# Altium schematic sheet analog_converter.SchDoc
size B; Address1: MILWAUKEE TOOL; Address2: 13135 W. Lisbon Rd.; Address3: Brookfield, WI 53005; SheetNumber: 1; SheetTotal: 1
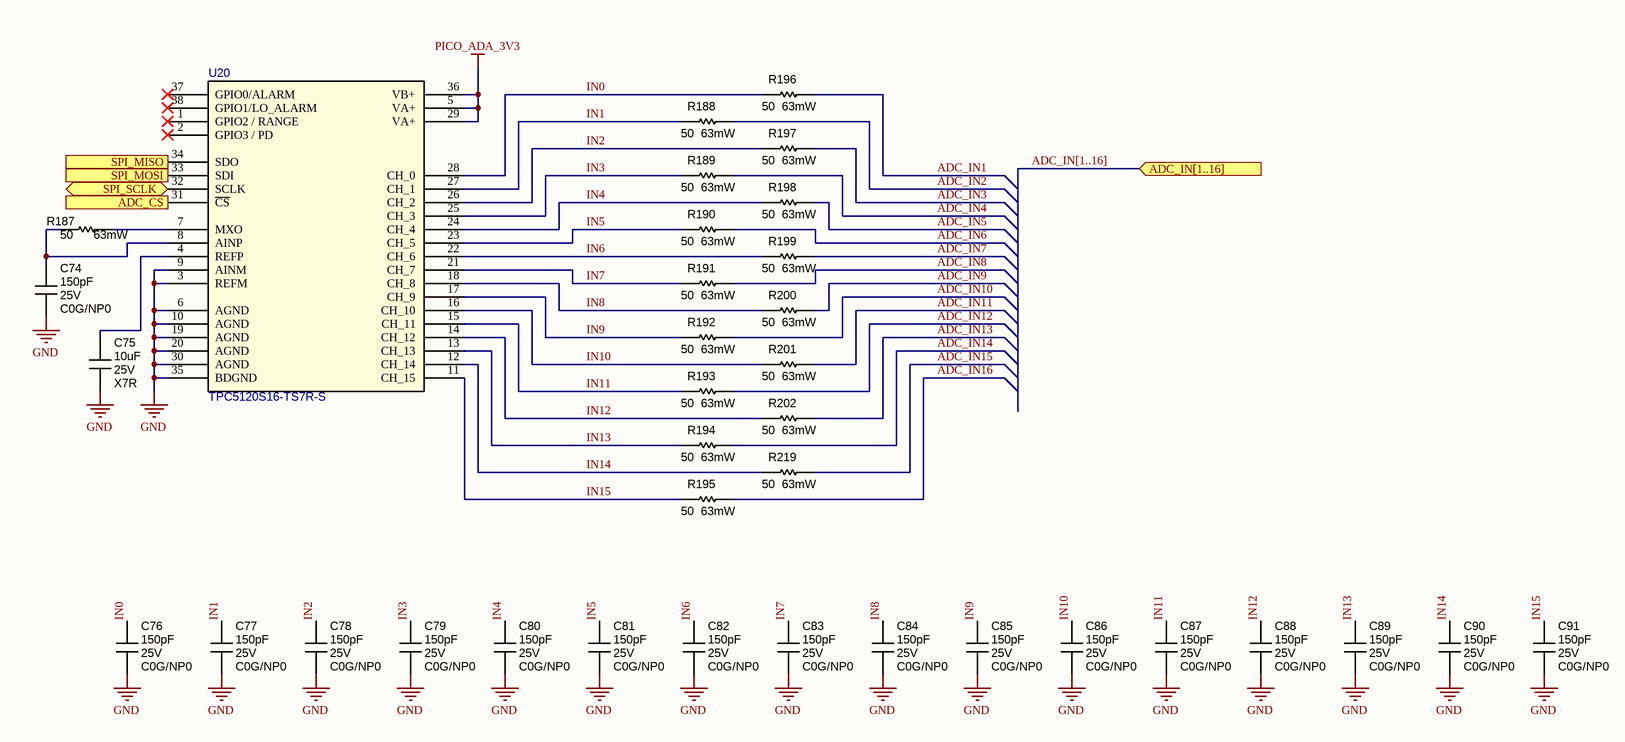
[diagram p0: analog_converter.SchDoc]

## Parts
C74  150pF  Voltage Rating: 25V  Temp Coeff: C0G/NP0  [CAPC1005X06N]
C75  10uF  Voltage Rating: 25V  Temp Coeff: X7R  [CAPC3225X28N]
C76  150pF  Voltage Rating: 25V  Temp Coeff: C0G/NP0  [CAPC1005X06N]
C77  150pF  Voltage Rating: 25V  Temp Coeff: C0G/NP0  [CAPC1005X06N]
C78  150pF  Voltage Rating: 25V  Temp Coeff: C0G/NP0  [CAPC1005X06N]
C79  150pF  Voltage Rating: 25V  Temp Coeff: C0G/NP0  [CAPC1005X06N]
C80  150pF  Voltage Rating: 25V  Temp Coeff: C0G/NP0  [CAPC1005X06N]
C81  150pF  Voltage Rating: 25V  Temp Coeff: C0G/NP0  [CAPC1005X06N]
C82  150pF  Voltage Rating: 25V  Temp Coeff: C0G/NP0  [CAPC1005X06N]
C83  150pF  Voltage Rating: 25V  Temp Coeff: C0G/NP0  [CAPC1005X06N]
C84  150pF  Voltage Rating: 25V  Temp Coeff: C0G/NP0  [CAPC1005X06N]
C85  150pF  Voltage Rating: 25V  Temp Coeff: C0G/NP0  [CAPC1005X06N]
C86  150pF  Voltage Rating: 25V  Temp Coeff: C0G/NP0  [CAPC1005X06N]
C87  150pF  Voltage Rating: 25V  Temp Coeff: C0G/NP0  [CAPC1005X06N]
C88  150pF  Voltage Rating: 25V  Temp Coeff: C0G/NP0  [CAPC1005X06N]
C89  150pF  Voltage Rating: 25V  Temp Coeff: C0G/NP0  [CAPC1005X06N]
C90  150pF  Voltage Rating: 25V  Temp Coeff: C0G/NP0  [CAPC1005X06N]
C91  150pF  Voltage Rating: 25V  Temp Coeff: C0G/NP0  [CAPC1005X06N]
R187  50  Wattage: 63mW  [RESC1005X04N]
R188  50  Wattage: 63mW  [RESC1005X04N]
R189  50  Wattage: 63mW  [RESC1005X04N]
R190  50  Wattage: 63mW  [RESC1005X04N]
R191  50  Wattage: 63mW  [RESC1005X04N]
R192  50  Wattage: 63mW  [RESC1005X04N]
R193  50  Wattage: 63mW  [RESC1005X04N]
R194  50  Wattage: 63mW  [RESC1005X04N]
R195  50  Wattage: 63mW  [RESC1005X04N]
R196  50  Wattage: 63mW  [RESC1005X04N]
R197  50  Wattage: 63mW  [RESC1005X04N]
R198  50  Wattage: 63mW  [RESC1005X04N]
R199  50  Wattage: 63mW  [RESC1005X04N]
R200  50  Wattage: 63mW  [RESC1005X04N]
R201  50  Wattage: 63mW  [RESC1005X04N]
R202  50  Wattage: 63mW  [RESC1005X04N]
R219  50  Wattage: 63mW  [RESC1005X04N]
U20  TPC5120S16-TS7R-S  [TSSOP50P640X120-38N]

## Ports
ADC_CS (in), ADC_IN[1..16] (in), SPI_MISO (out), SPI_MOSI (in), SPI_SCLK (bidir)

## Nets
GND: C74.2 C75.2 C76.2 C77.2 C78.2 C79.2 C80.2 C81.2 C82.2 C83.2 C84.2 C85.2 C86.2 C87.2 C88.2 C89.2 C90.2 C91.2 U20.3(REFM) U20.6(AGND) U20.9(AINM) U20.10(AGND) U20.19(AGND) U20.20(AGND) U20.30(AGND) U20.35(BDGND)
PICO_ADA_3V3: U20.5(VA+) U20.29(VA+) U20.36(VB+)
ADC_CS: U20.31(~{CS}) ; port ADC_CS
ADC_IN1: R196.2
ADC_IN2: R188.2
ADC_IN3: R197.2
ADC_IN4: R189.2
ADC_IN5: R198.2
ADC_IN6: R190.2
ADC_IN7: R199.2
ADC_IN8: R191.2
ADC_IN9: R200.2
ADC_IN10: R192.2
ADC_IN11: R201.2
ADC_IN12: R193.2
ADC_IN13: R202.2
ADC_IN14: R194.2
ADC_IN15: R219.2
ADC_IN16: R195.2
IN0: C76.1 R196.1 U20.28(CH_0)
IN1: C77.1 R188.1 U20.27(CH_1)
IN2: C78.1 R197.1 U20.26(CH_2)
IN3: C79.1 R189.1 U20.25(CH_3)
IN4: C80.1 R198.1 U20.24(CH_4)
IN5: C81.1 R190.1 U20.23(CH_5)
IN6: C82.1 R199.1 U20.22(CH_6)
IN7: C83.1 R191.1 U20.21(CH_7)
IN8: C84.1 R200.1 U20.18(CH_8)
IN9: C85.1 R192.1 U20.17(CH_9)
IN10: C86.1 R201.1 U20.16(CH_10)
IN11: C87.1 R193.1 U20.15(CH_11)
IN12: C88.1 R202.1 U20.14(CH_12)
IN13: C89.1 R194.1 U20.13(CH_13)
IN14: C90.1 R219.1 U20.12(CH_14)
IN15: C91.1 R195.1 U20.11(CH_15)
SPI_MISO: U20.34(SDO) ; port SPI_MISO
SPI_MOSI: U20.33(SDI) ; port SPI_MOSI
SPI_SCLK: U20.32(SCLK) ; port SPI_SCLK
NetC74_1: C74.1 R187.1 U20.8(AINP)
NetC75_1: C75.1 U20.4(REFP)
NetR187_2: R187.2 U20.7(MXO)

Not connected (* = marked no-connect by the designer): U20 1(GPIO2_/_RANGE)* 2(GPIO3_/_PD)* 37(GPIO0/ALARM)* 38(GPIO1/LO_ALARM)*

## Buses and harness runs
bus ADC_IN[1..16] = port ADC_IN[1..16]

## Notes on the sheet
- Schematic Notes
- Schematic Revision History
- Title
- ALL CAPACITORS ARE CERAMIC, 0603, 50V, 10%, X7R UNLESS OTHERWISE STATED
- ALL RESISTORS ARE FILM, 0603, 1/10W, 5%, 200ppm/°C UNLESS OTHERWISE STATED
- Size:
- Date:
- B
- Number:
- Sheet
- Revision:
- of
- Drawn By:
- Brookfield, WI 53005
- File:
- Platform Base:
- Engineer:
- This Document is the property of MILWAUKEE TOOL and may not be reproduced, in any form, without the written premission of MILWAUKEE TOOL.

## Library data of the parts
C74 C76-C91 = CMP-004-0079: CAP CER 150PF 25V C0G/NP0 0402; MFR#: C0402C151J3GACTU; MFR: KEMET; MFR2#: CC0402JRNPO8BN151; Tolerance: 5%; Populate: Yes; Temp Range: -55 / +125 C; Capacitor Type: Ceramic; Case Code (Imperial): 0402; Value: 150pF; Design Item ID: CN/150PF/25V/C0G,NP0/5%/0402; Case Code (Metric): 1005; ComponentLink1URL: https://search.murata.co.jp/Ceramy/image/img/A01X/G101/ENG/GCM155R71H103KA55-01.pdf; MFR2: Yageo; ComponentLink1Description: Datasheet; RoHS Compliant: Yes; Part Status: Production
C75 = CMP-004-0004: CAP CER 10UF 25V X7R 1206; MFR#: GRM31CR71E106KA12L; MFR2#: C3216X7R1E106K160AB; MFR: Murata Electronics; Capacitor Type: Ceramic; Tolerance: 10%; Temp Range: -55 / +125 C; REACH SVHC: Yes; Value: 10uF; Height: 1.6mm; ComponentLink1Description: Datasheet; MFR2: TDK Corporation; Case Code (Metric): 3216; ComponentLink1URL: https://www.murata.com/-/media/webrenewal/support/library/catalog/products/capacitor/ceramiccapacitor/c02e.ashx?la=en-us&cvid=20210120024548000000; RoHS Compliant: Yes; Case Code (Imperial): 1206; Design Item ID: CN/10uF/25V/X7R/10%/1206
R187-R202 R219 = CMP-025-0174: RES SMD 50R OHM 1% 1/16W 0402; MFR#: RN73R1ETTP50R0F50; MFR: KOA Speer Electronics; Value: 50 Ohm; Temp Range: -55 / +155 C; Temperature Coefficient: 50 ppm/°C; Populate: Yes; Tolerance: 1%; ComponentLink1Description: Datasheet; ComponentLink1URL: https://www.koaspeer.com/pdfs/RN73R.pdf; Resistor Type: Thick Film; Case Code (Imperial): 0402; Case Code (Metric): 1005; Design Item ID: R/50.0/0.063W/1%/0402; RoHS Compliant: Yes; Part Status: Production
U20 = CMP-017-0116: IC 12 BIT ANALOG TO DIGITAL CONVERT SPI; MFR: 3PEAK; Populate: Yes; REACFH SVCH: Unaffected; Temp Range, Ambient: -40 / +125 C; Voltage Range: 2.7V - 5.25V DC; Temp Range, Junction: -40 / +150C; Value: TPC5120S16-TS7R-S; MFR#: TPC5120S16-TS7R-S; Case Package: TSSOP38; Design Item ID: IC/ADC/12BIT/TPC5120S16-TS7R-S/3PEAK; Part Status: Production; RoHS Comliant: Yes; Type: THERMOCOUPLE; ComponentLink1Description: Datasheet; ComponentLink1URL: https://static.3peak.com/res/doc/ds/Datasheet_TPC5120-TPC5121.pdf